# EAGLE design expansion_board (EAGLE 6.5.0)
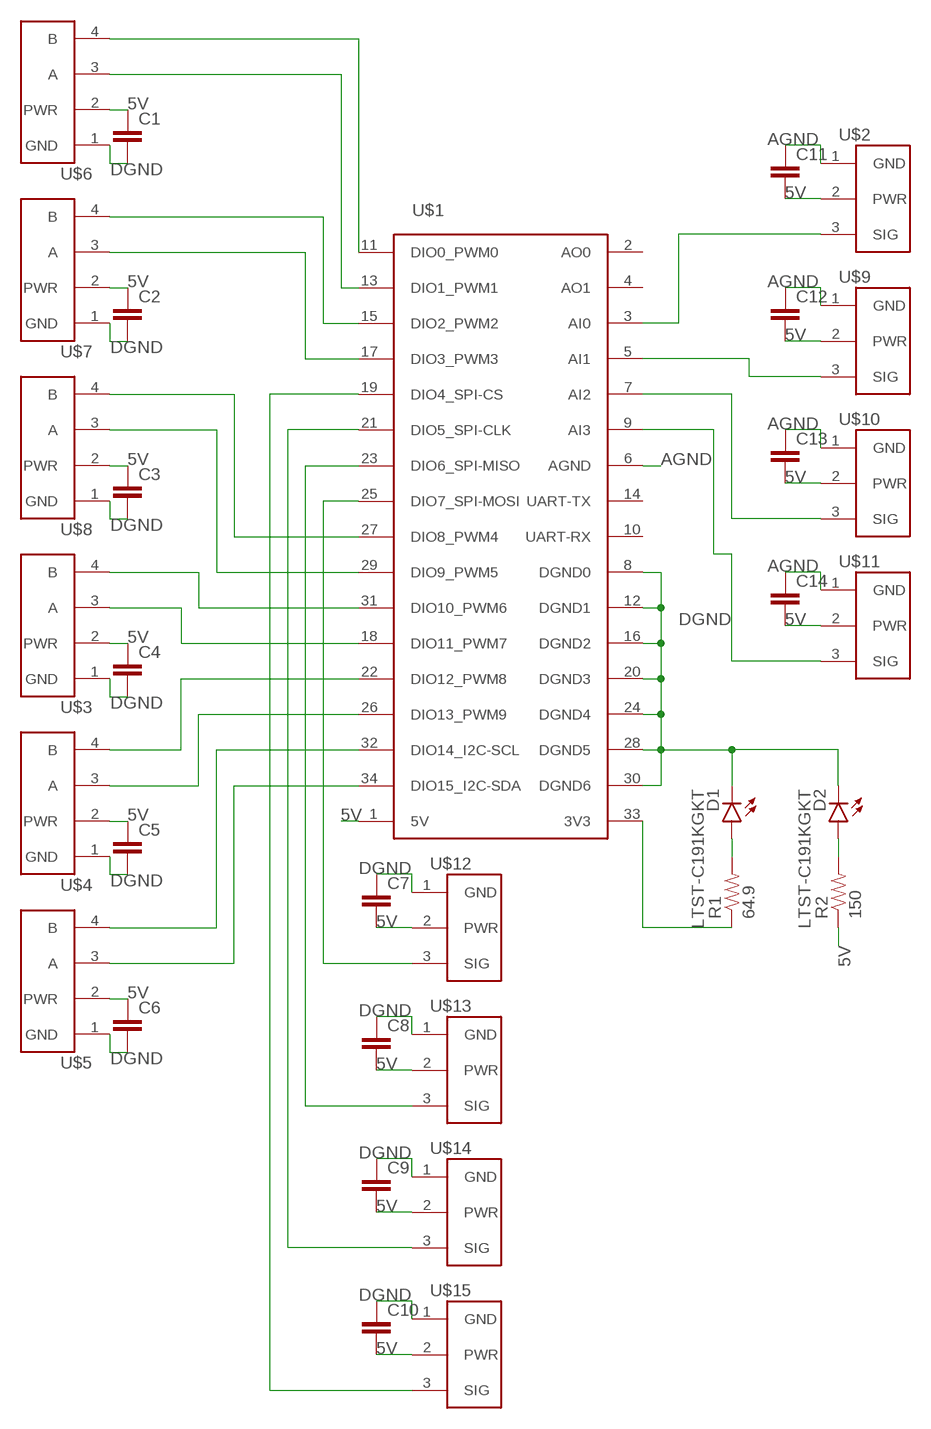
[diagram p0: schematic, sheet 1]

## Parts
C1  CAP0603  [0603]
C2  CAP0603  [0603]
C3  CAP0603  [0603]
C4  CAP0603  [0603]
C5  CAP0603  [0603]
C6  CAP0603  [0603]
C7  CAP0603  [0603]
C8  CAP0603  [0603]
C9  CAP0603  [0603]
C10  CAP0603  [0603]
C11  CAP0603  [0603]
C12  CAP0603  [0603]
C13  CAP0603  [0603]
C14  CAP0603  [0603]
D1  LTST-C191KGKT  LED-GREEN0603  [LED-0603]
D2  LTST-C191KGKT  LED-GREEN0603  [LED-0603]
R1  64.9  RESISTOR0603-RES  [0603-RES]
R2  150  RESISTOR0603-RES  [0603-RES]
U$1  MXP  [SFH11-PBPC-D17-ST-BK]
U$2  22-23-2031  [22-23-2031]
U$3  22-23-2041  [22-23-2041]
U$4  22-23-2041  [22-23-2041]
U$5  22-23-2041  [22-23-2041]
U$6  22-23-2041  [22-23-2041]
U$7  22-23-2041  [22-23-2041]
U$8  22-23-2041  [22-23-2041]
U$9  22-23-2031  [22-23-2031]
U$10  22-23-2031  [22-23-2031]
U$11  22-23-2031  [22-23-2031]
U$12  22-23-2031  [22-23-2031]
U$13  22-23-2031  [22-23-2031]
U$14  22-23-2031  [22-23-2031]
U$15  22-23-2031  [22-23-2031]

## Nets
5V: C1.1 C2.1 C3.1 C4.1 C5.1 C6.1 C7.2 C8.2 C9.2 C10.2 C11.2 C12.2 C13.2 C14.2 R2.1 U$1.1(5V) U$2.2(PWR) U$3.2(PWR) U$4.2(PWR) U$5.2(PWR) U$6.2(PWR) U$7.2(PWR) U$8.2(PWR) U$9.2(PWR) U$10.2(PWR) U$11.2(PWR) U$12.2(PWR) U$13.2(PWR) U$14.2(PWR) U$15.2(PWR)
AGND: C11.1 C12.1 C13.1 C14.1 U$1.6(AGND) U$2.1(GND) U$9.1(GND) U$10.1(GND) U$11.1(GND)
DGND: C1.2 C2.2 C3.2 C4.2 C5.2 C6.2 C7.1 C8.1 C9.1 C10.1 D1.C D2.C U$1.8(DGND0) U$1.12(DGND1) U$1.16(DGND2) U$1.20(DGND3) U$1.24(DGND4) U$1.28(DGND5) U$1.30(DGND6) U$3.1(GND) U$4.1(GND) U$5.1(GND) U$6.1(GND) U$7.1(GND) U$8.1(GND) U$12.1(GND) U$13.1(GND) U$14.1(GND) U$15.1(GND)
N$1: U$1.11(DIO0_PWM0) U$6.4(B)
N$2: U$1.13(DIO1_PWM1) U$6.3(A)
N$3: U$1.15(DIO2_PWM2) U$7.4(B)
N$4: U$1.17(DIO3_PWM3) U$7.3(A)
N$5: U$1.27(DIO8_PWM4) U$8.4(B)
N$6: U$1.29(DIO9_PWM5) U$8.3(A)
N$7: U$1.31(DIO10_PWM6) U$3.4(B)
N$8: U$1.18(DIO11_PWM7) U$3.3(A)
N$9: U$1.22(DIO12_PWM8) U$4.4(B)
N$10: U$1.26(DIO13_PWM9) U$4.3(A)
N$11: U$1.32(DIO14_I2C-SCL) U$5.4(B)
N$12: U$1.34(DIO15_I2C-SDA) U$5.3(A)
N$13: U$1.3(AI0) U$2.3(SIG)
N$14: U$1.5(AI1) U$9.3(SIG)
N$15: U$1.7(AI2) U$10.3(SIG)
N$16: U$1.9(AI3) U$11.3(SIG)
N$17: U$1.25(DIO7_SPI-MOSI) U$12.3(SIG)
N$18: U$1.23(DIO6_SPI-MISO) U$13.3(SIG)
N$19: U$1.21(DIO5_SPI-CLK) U$14.3(SIG)
N$20: U$1.19(DIO4_SPI-CS) U$15.3(SIG)
N$23: D1.A R1.2
N$24: R1.1 U$1.33(3V3)
N$25: D2.A R2.2
Unconnected: U$1.2(AO0) U$1.4(AO1) U$1.10(UART-RX) U$1.14(UART-TX)

## Library data of the parts
C1-C14 = custom:CAP: Capacitor Standard 0603 ceramic capacitor, and 0.1" leaded capacitor.
D1 D2 = SparkFun-LED:LED-GREEN: Various green LEDs Green LEDs used in SFE Production 0603- DIO-00821 LARGE- DIO-00862 LILYPAD- DIO-09910; PROD_ID: DIO-00821; VALUE: GREEN
R1 R2 = SparkFun-Passives:RESISTOR: Resistor Basic schematic elements and footprints for 0603, 1206, and PTH resistors.
U$1 = custom:MXP: NI MXP female connector.
U$2 U$9-U$15 = custom:22-23-2031: Molex 3-pin male connector 22-23-2031.
U$3-U$8 = custom:22-23-2041: Molex 4-pin male connector 22-23-2041.

## Board
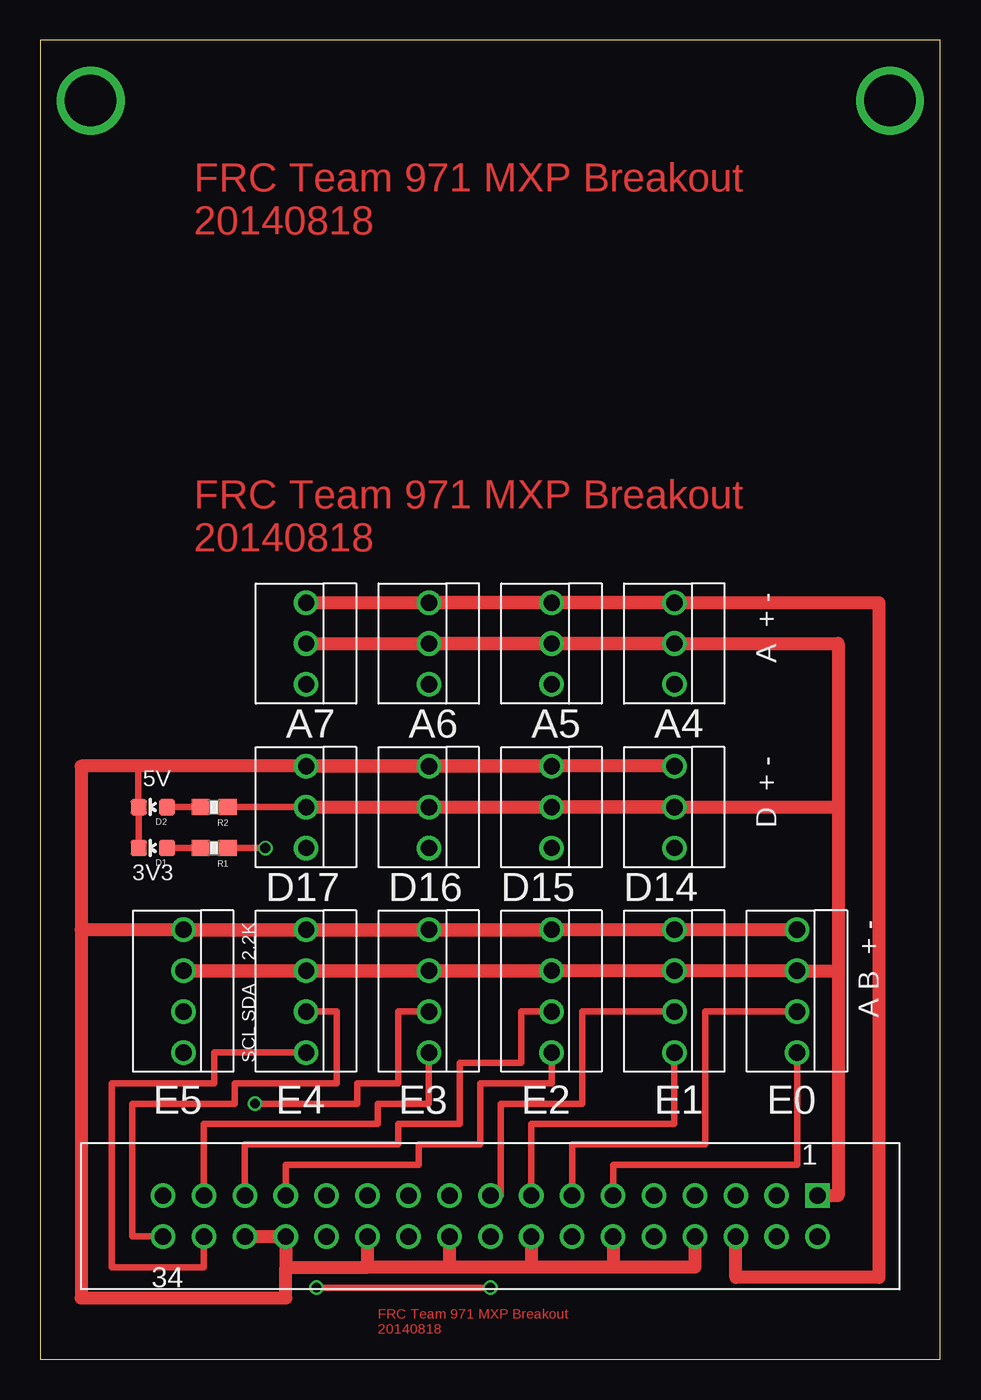
[diagram p1: board, top side]
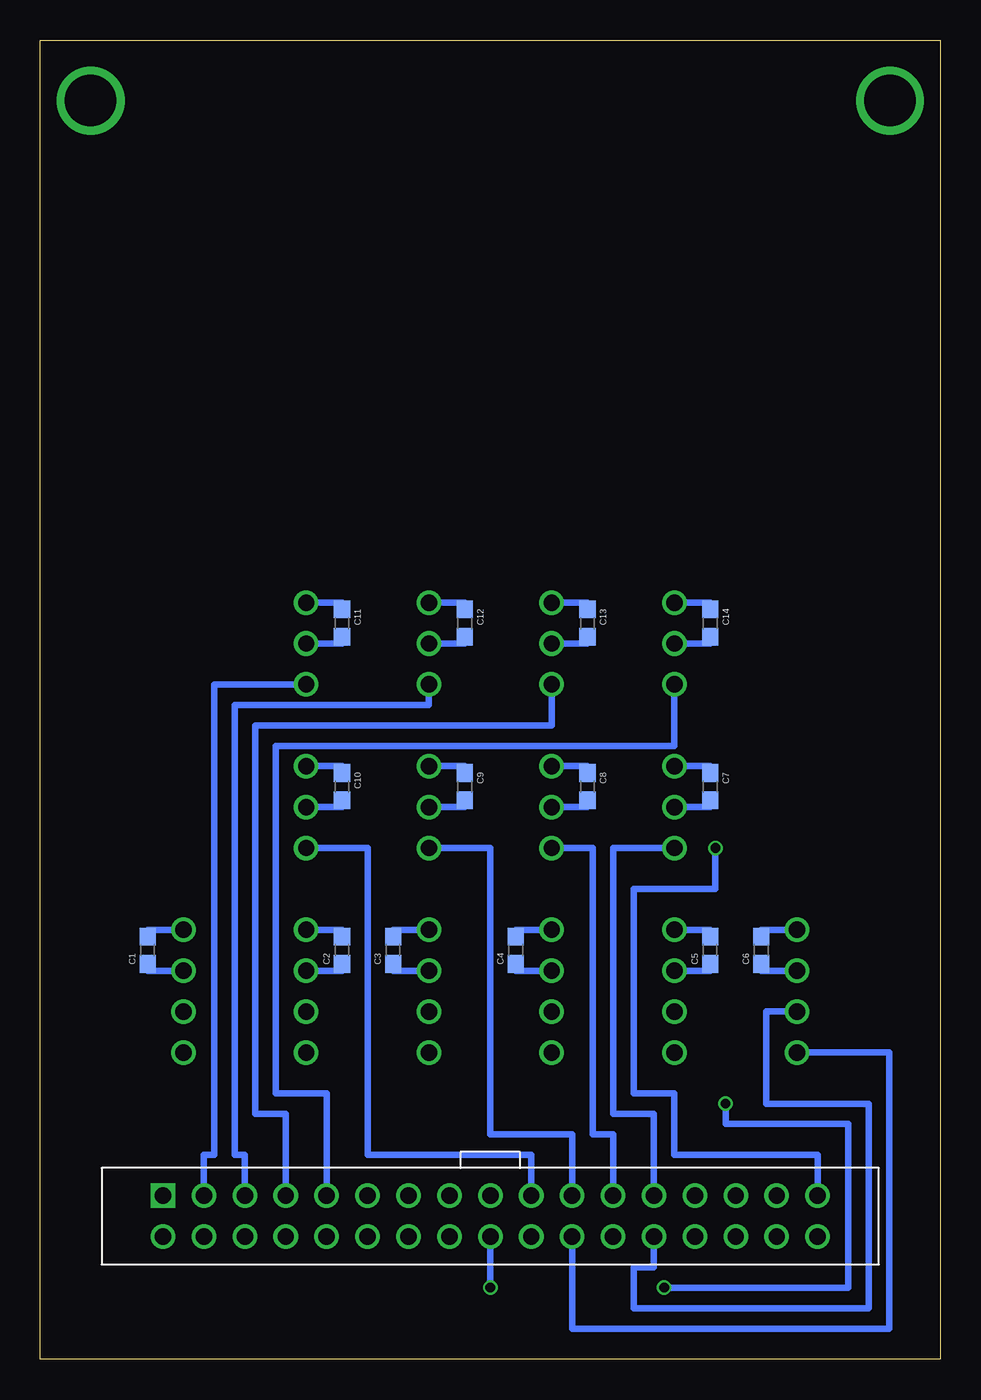
[diagram p2: board, bottom side, seen from below]

Size 55.88 x 81.92 mm. Coordinates in mm from the lower left corner, seen from the top.
Outline: 0,0 55.88,0 55.88,81.92 0,81.92 0,0
Copper layers (1*16): Top 0.035mm / dielectric 1.5mm / Bottom 0.035mm
Design rules "SeeedStudio_2layer_DRU_no_angle_20140221 *": minimum track width 6mil, minimum drill 12mil, track to track 6mil, track to pad 6mil, pad to pad 6mil, via to via 6mil, smd to smd 0mil, copper to edge 10mil, drill to drill 10mil, minimum pad ring 10mil, minimum via ring 6mil, stop-mask expansion 2mil, vias tented up to drill 100mil, thermal gap 10mil

### Footprints (pad centres in the part's own frame; a part is rotated, then mirrored left to right if it is on the bottom)
0603 = smd 1.1 x 1: 1 -0.85,0; 2 0.85,0
LED-0603 = smd 1 x 1: A 0,-0.877; C 0,0.877
0603-RES = smd 1.1 x 1: 1 -0.85,0; 2 0.85,0
SFH11-PBPC-D17-ST-BK = drill 1.016 square: 1 1.27,-20.32 | drill 1.016: 2 -1.27,-20.32; 3 1.27,-17.78; 4 -1.27,-17.78; 5 1.27,-15.24; 6 -1.27,-15.24; 7 1.27,-12.7; 8 -1.27,-12.7; 9 1.27,-10.16; 10 -1.27,-10.16; 11 1.27,-7.62; 12 -1.27,-7.62; 13 1.27,-5.08; 14 -1.27,-5.08; 15 1.27,-2.54; 16 -1.27,-2.54; 17 1.27,0; 18 -1.27,0; 19 1.27,2.54; 20 -1.27,2.54; 21 1.27,5.08; 22 -1.27,5.08; 23 1.27,7.62; 24 -1.27,7.62; 25 1.27,10.16; 26 -1.27,10.16; 27 1.27,12.7; 28 -1.27,12.7; 29 1.27,15.24; 30 -1.27,15.24; 31 1.27,17.78; 32 -1.27,17.78; 33 1.27,20.32; 34 -1.27,20.32
22-23-2031 = drill 1.016: 1 0,2.54; 2 0,0; 3 0,-2.54
22-23-2041 = drill 1.016: 1 0,3.81; 2 0,1.27; 3 0,-1.27; 4 0,-3.81

### Placement (x,y rotation side)
C1  49.21,25.4 90 bottom
C2  37.15,25.4 90 bottom
C3  33.97,25.4 90 bottom
C4  26.35,25.4 90 bottom
C5  14.29,25.4 90 bottom
C6  11.11,25.4 90 bottom
C7  14.29,35.56 270 bottom
C8  21.91,35.56 270 bottom
C9  29.53,35.56 270 bottom
C10  37.15,35.56 270 bottom
C11  37.15,45.72 270 bottom
C12  29.53,45.72 270 bottom
C13  21.91,45.72 270 bottom
C14  14.29,45.72 270 bottom
D1  6.99,31.75 90 top
D2  6.99,34.29 90 top
R1  10.79,31.75 180 top
R2  10.79,34.29 180 top
U$1  27.94,8.89 90 top
U$2  39.37,44.45 0 top
U$3  24.13,22.86 0 top
U$4  8.89,22.86 0 top
U$5  16.51,22.86 0 top
U$6  46.99,22.86 0 top
U$7  39.37,22.86 0 top
U$8  31.75,22.86 0 top
U$9  31.75,44.45 0 top
U$10  24.13,44.45 0 top
U$11  16.51,44.45 0 top
U$12  16.51,34.29 0 top
U$13  24.13,34.29 0 top
U$14  31.75,34.29 0 top
U$15  39.37,34.29 0 top

### Tracks (layer width: path | path; a pad name or v marks a point on that pad's centre or on a via)
5V
  Top 0.406: R2.1 U$12.2
  Top 0.813: U$12.2 U$13.2 | U$13.2 U$15.2 U$14.2 | U$10.2 U$9.2 U$2.2 U$11.2 49.53,44.45 49.53,34.29 | U$5.2 U$3.2 U$8.2 U$4.2 U$7.2 U$6.2 49.53,24.13 | 49.53,34.29 49.53,24.13 | 49.53,24.13 49.53,10.16 U$1.1 | U$13.2 49.53,34.29
  Bottom 0.406: C1.1 49.21,24.13 U$6.2 | C2.1 37.15,24.13 U$7.2 | C3.1 33.97,24.13 U$8.2 | C4.1 26.35,24.13 U$3.2 | C5.1 14.29,24.13 U$5.2 | C6.1 11.11,24.13 U$4.2 | C7.2 14.29,34.29 U$12.2 | C8.2 21.91,34.29 U$13.2 | C9.2 29.53,34.29 U$14.2 | C10.2 37.15,34.29 U$15.2 | C14.2 14.29,44.45 U$11.2 | C13.2 21.91,44.45 U$10.2 | C12.2 29.53,44.45 U$9.2 | C11.2 37.15,44.45 U$2.2
AGND
  Top 0.813: U$10.1 U$9.1 U$2.1 U$11.1 52.07,46.99 52.07,5.08 43.18,5.08 U$1.6
  Bottom 0.406: C14.1 14.29,46.99 U$11.1 | C13.1 21.91,46.99 U$10.1 | C12.1 29.53,46.99 U$9.1 | C11.1 37.15,46.99 U$2.1
DGND
  Top 0.406: D1.C D2.C 6.1,34.29 6.1,36.83
  Top 0.813: U$6.1 U$7.1 U$4.1 U$8.1 U$3.1 U$5.1 2.54,26.67 | U$13.1 U$12.1 U$14.1 | U$15.1 U$14.1 | U$1.30 U$1.28 15.24,5.71 | 15.24,5.71 20.32,5.71 | 20.32,5.71 U$1.24 | U$1.20 25.4,5.71 | 25.4,5.71 20.32,5.71 | U$1.8 40.64,5.71 35.56,5.71 | 35.56,5.71 30.48,5.71 | 30.48,5.71 25.4,5.71 | U$1.16 30.48,5.71 | U$1.12 35.56,5.71 | U$14.1 6.1,36.83 2.54,36.83 2.54,26.67 | 2.54,26.67 2.54,3.81 15.24,3.81 15.24,5.71
  Bottom 0.406: C1.2 49.21,26.67 U$6.1 | C2.2 37.15,26.67 U$7.1 | C3.2 33.97,26.67 U$8.1 | C4.2 26.35,26.67 U$3.1 | C5.2 14.29,26.67 U$5.1 | C6.2 11.11,26.67 U$4.1 | C7.1 14.29,36.83 U$12.1 | C8.1 21.91,36.83 U$13.1 | C9.1 29.53,36.83 U$14.1 | C10.1 37.15,36.83 U$15.1
N$1
  Top 0.406: U$6.4 46.99,12.06 35.56,12.06 U$1.11
N$2
  Top 0.406: U$6.3 41.27,21.59 41.27,13.34 33.02,13.34 U$1.13
N$3
  Top 0.406: U$7.4 39.37,14.61 30.48,14.61 U$1.15
N$4
  Top 0.406: U$7.3 33.66,21.59 33.66,15.88 28.57,15.88 28.57,10.16 U$1.17
N$5
  Top 0.406: U$8.4 31.75,17.14 27.3,17.14 27.3,13.34 23.5,13.34 23.5,12.06 15.24,12.06 U$1.27
N$6
  Top 0.406: U$8.3 29.84,21.59 29.84,18.41 26.04,18.41 26.04,14.61 22.23,14.61 22.23,13.34 12.7,13.34 U$1.29
N$7
  Top 0.406: U$3.4 24.13,15.88 20.95,15.88 20.95,14.61 10.16,14.61 U$1.31
N$8  (via drill 0.6)
  Top 0.406: U$3.3 22.23,21.59 22.23,17.14 19.68,17.14 19.68,15.88 v13.34,15.88 | v17.14,4.45 v27.94,4.45
  Bottom 0.406: v13.34,15.88 13.34,14.61 5.71,14.61 5.71,4.45 v17.14,4.45 | v27.94,4.45 U$1.18
N$9
  Bottom 0.406: U$4.4 3.17,19.05 3.17,1.91 22.86,1.91 U$1.22
N$10
  Bottom 0.406: U$4.3 10.79,21.59 10.79,15.88 4.45,15.88 4.45,3.17 19.05,3.17 19.05,5.71 17.78,5.71 U$1.26
N$11
  Top 0.406: U$5.4 10.79,19.05 10.79,17.14 4.45,17.14 4.45,5.71 10.16,5.71 U$1.32
N$12
  Top 0.406: U$5.3 18.41,21.59 18.41,17.14 12.06,17.14 12.06,15.88 5.71,15.88 5.71,7.62 U$1.34
N$13
  Bottom 0.406: U$2.3 45.09,41.91 45.09,12.7 45.72,12.7 U$1.3
N$14
  Bottom 0.406: U$9.3 31.75,40.64 43.81,40.64 43.81,12.7 43.18,12.7 U$1.5
N$15
  Bottom 0.406: U$10.3 24.13,39.37 42.55,39.37 42.55,15.24 40.64,15.24 U$1.7
N$16
  Bottom 0.406: U$11.3 16.51,38.1 41.27,38.1 41.27,16.51 38.1,16.51 U$1.9
N$17
  Bottom 0.406: U$12.3 20.32,31.75 20.32,15.24 17.78,15.24 U$1.25
N$18
  Bottom 0.406: U$13.3 21.59,31.75 21.59,13.97 20.32,13.97 U$1.23
N$19
  Bottom 0.406: U$14.3 27.94,31.75 27.94,13.97 22.86,13.97 U$1.21
N$20
  Bottom 0.406: U$15.3 35.56,31.75 35.56,12.7 25.4,12.7 U$1.19
N$21  (via drill 3.2)
  other vias: 3.12,78.17
N$22  (via drill 3.2)
  other vias: 52.76,78.17
N$23
  Top 0.406: R1.2 D1.A
N$24  (via drill 0.6)
  Top 0.406: v13.97,31.75 R1.1
  Bottom 0.406: U$1.33 7.62,12.7 16.51,12.7 16.51,16.51 19.05,16.51 19.05,29.21 13.97,29.21 v13.97,31.75
N$25
  Top 0.406: R2.2 D2.A

### Text on the board
Top: FRC Team 971 MXP Breakout / 20140818 | FRC Team 971 MXP Breakout / 20140818 | FRC Team 971 MXP Breakout / 20140818
tPlace: A + - | A7 | A6 | A5 | A4 | D + - | 5V | 3V3 | D17 | D16 | D15 | D14 | A B + - | 2.2K | SDA | SCL | E5 | E4 | E3 | E2 | E1 | E0